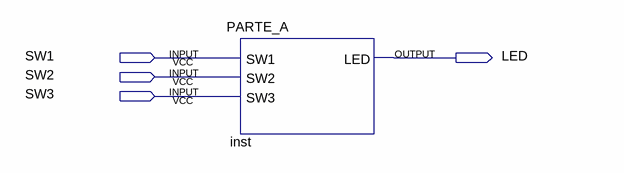
[diagram p0: schematic sheet]
// Quartus schematic Esquematico2.bdf as structural Verilog: 1 symbols, 4 pins
module Esquematico2 (
  input  SW1,
  input  SW2,
  input  SW3,
  output LED
);

  PARTE_A inst (.SW1(SW1), .SW2(SW2), .SW3(SW3), .LED(LED));
endmodule
